# Altium project ConnectorBoard.PrjPcb
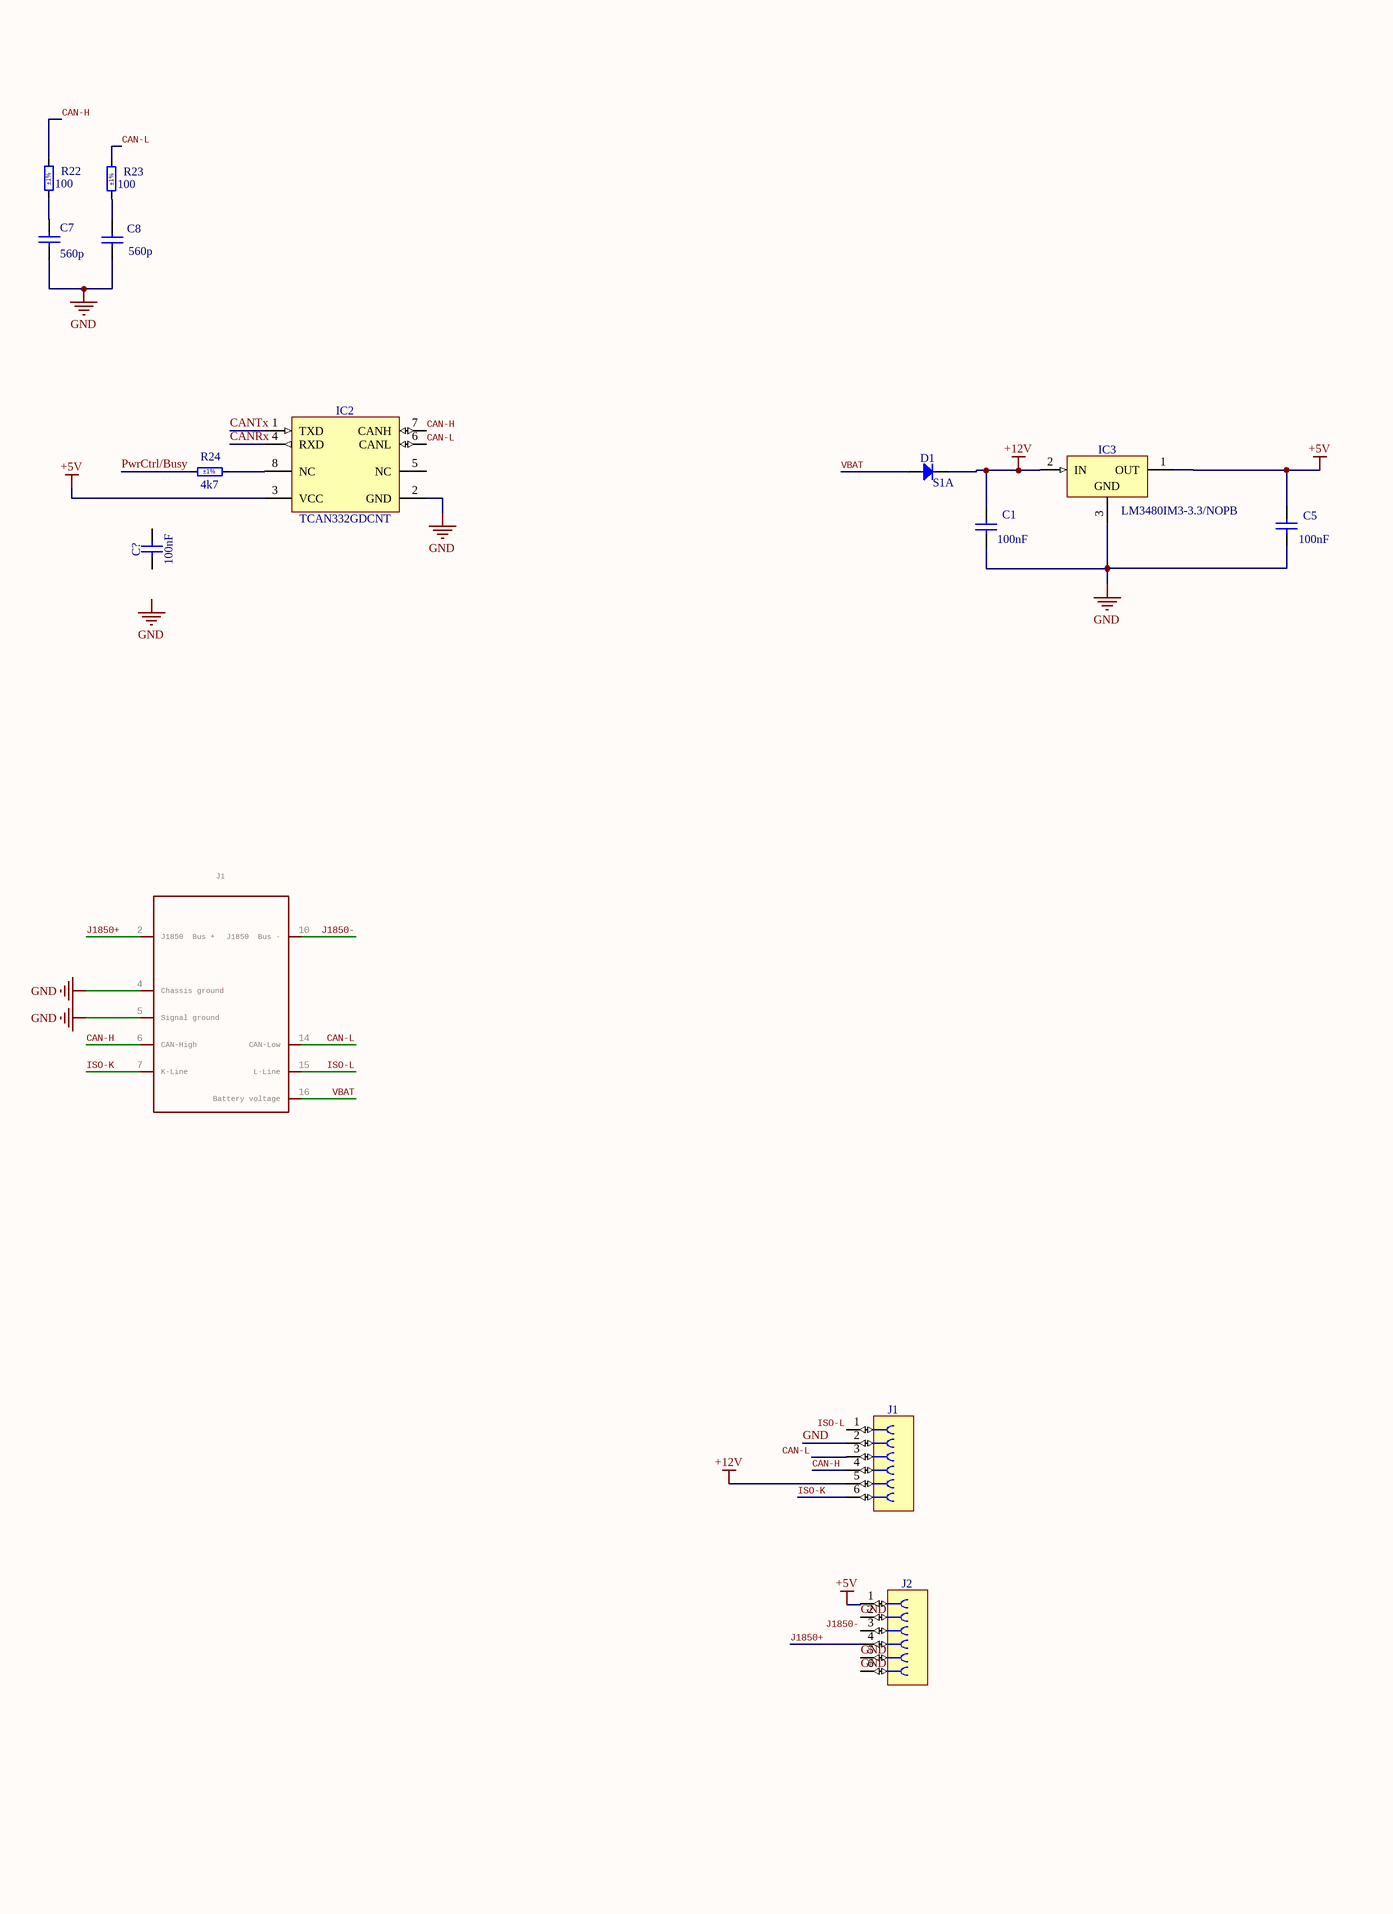
[diagram p0: ConnectorBoard.SchDoc]
1 sheet, 14 parts. Net scope: global (net labels, ports and power ports of the same name join across sheets).
Board file: ConnectorBoard.PcbDoc

## Sheet ConnectorBoard.SchDoc
size 260 x 358 mm; Origin: Eagle; OriginPath: C:\Users\Bimbo\Downloads\ELM327-based OBD-II interface.sch; OriginSheet: 1

### Parts
(Parts that share a designator on the sheet are numbered #1, #2 ... from top to bottom, then left to right.)
C1  100nF  [CAPC2012X135N]
C5  100nF  [CAPC2012X135N]
C7  560p  [CAPC2012X135N]
C8  560p  [CAPC2012X135N]
C?  100nF  [CAPC2012X135N]
D1  S1A  [DIOM5227X270N]
IC2  TCAN332GDCNT  [SOT65P280X145-8N]
IC3  LM3480IM3-3.3/NOPB  [SOT95P237X112-3N]
J1#1  J1850
Bus+: J1850 / Bus +  Signalground: Signal ground  J1850
Bus-: J1850 / Bus -  Batteryvoltage: Battery voltage  Chassisground: Chassis ground  [J1962_OBD_CONNECTOR]
J1#2  Socket 6  [3M_929974-01-06-RK]  (value not drawn)
J2  Socket 6  [3M_929974-01-06-RK]  (value not drawn)
R22  100  Tolerance: ±1%  [RESC2012X60N]
R23  100  Tolerance: ±1%  [RESC2012X60N]
R24  4k7  Tolerance: ±1%  [RESC2012X60N]

### Nets
+5V: C5.2 IC2.3(VCC) IC3.1(OUT) J2.1
+12V: C1.2 D1.1(C) IC3.2(IN) J1#2.5
GND: C1.1 C5.1 C7.1 C8.1 IC2.2(GND) IC3.3(GND) J1#1.4 J1#1.5 J1#2.2 J2.2 J2.5 J2.6
CAN-H: IC2.7(CANH) J1#1.6 J1#2.4 R22.2
CAN-L: IC2.6(CANL) J1#1.14 J1#2.3 R23.2
CANRx: IC2.4(RXD)
CANTx: IC2.1(TXD)
ISO-K: J1#1.7 J1#2.6
ISO-L: J1#1.15 J1#2.1
J1850+: J1#1.2 J2.4
J1850-: J1#1.10 J2.3
PwrCtrl/Busy: R24.2
VBAT: D1.2(A) J1#1.16
NetC7_2: C7.2 R22.1
NetC8_2: C8.2 R23.1
NetIC2_8: IC2.8(NC) R24.1

Not connected (* = marked no-connect by the designer): C? 1 2; IC2 5(NC)

### Notes on the sheet
- Labels drawn without touching a wire or pin: GND

### Library data of the parts
C1 C5 C7 C8 C? = CC0805_100NF_50V_10%_X7R: Non-polarised capacitor; Part Description: SMD Multilayer Chip Ceramic Capacitor; Manufacturer: GENERIC; Manufacturer1 Part Number: C2012X7R1H104K085; Voltage: 50V; TC: X7R; Tolerance: ±10%; Part Number: CC0805_100NF_50V_10%_X7R; Component Kind: Standard; Component Type: Standard; Pin Count: 2; Status: Preferred; Manufacturer Part Number: CC0805_100NF_50V_10%_X7R; Case: 0805; Mounted: Yes; Socket: No; SMD: Yes; Sense: No; Manufacturer1 Example: TDK; Manufacturer1 ComponentHeight: 1mm; HelpURL: \\cern.ch\dfs\Applications\Altium\Datasheets\CC0805_X7R_TDK_C.pdf; Author: CERN DEM JLC; CreateDate: 03.12.2007; LatestRevisionDate: 22.04.2015
  C1 C5 C?: Value: 100nF
  C7 C8: Value: 560p
D1 = S1A: Diode; Part Description: Surface Mount Glass Passivated Rectifier; Manufacturer: FAIRCHILD SEMICONDUCTOR; Voltage: 50V; Power: 1A; PressFit: No; Bonding: No; Part Number: S1A; Component Kind: Standard; Component Type: Standard; Device: S1A; PackageDescription: DO-214-AC/SMA Diode, Molded Body; 5.20mm L X 2.725mm W X 2.70mm H, IPC Medium Density; Manufacturer Part Number: S1A; Pin Count: 2; Case: DO-214AC; Mounted: Yes; Socket: No; SMD: Yes; Sense: No; ComponentHeight: 2.70mm; HelpURL: \\cern.ch\dfs\Applications\Altium\Datasheets\S1A.pdf; Author: CERN DEM JLC; CreateDate: 10.05.2010; LatestRevisionDate: 13.06.2012
IC2 = TCAN332GDCNT: 3.3V CAN Transceivers with CAN FD (Flexible Data Rate); Manufacturer: TEXAS INSTRUMENTS; PressFit: No; Bonding: No; Part Number: TCAN332GDCNT; Component Kind: Standard; Component Type: Standard; Device: TCAN332GDCNT; PackageDescription: SOT, 0.65mm Pitch; 8 pin, 1.625mm W X 2.90mm L X 1.45mm H body, IPC Medium Density; Part Description: 3.3V CAN Transceivers with CAN FD (Flexible Data Rate); Manufacturer Part Number: TCAN332GDCNT; Pin Count: 8; Case: SOT23-8; Mounted: Yes; Socket: No; SMD: Yes; Sense: No; ComponentHeight: 1.45mm; Author: CERN DEM JLC; HelpURL: \\cern.ch\dfs\Applications\Altium\Datasheets\TCAN332GDCNT.pdf; CreateDate: 22.08.2017; LatestRevisionDate: 22.08.2017
IC3 = LM3480IM3-3.3/NOPB: 3-Terminal Regulator 1=OUT 2=IN 3=GND; Part Description: 3.3V, 100 mA Quasi Low-Dropout Linear Voltage Regulator; Manufacturer: TEXAS INSTRUMENTS; PressFit: No; Bonding: No; Part Number: LM3480IM3-3.3/NOPB; Component Kind: Standard; Component Type: Standard; Device: LM3480IM3-3.3/NOPB; PackageDescription: SOT, 0.95mm, pitch; 3 pin,1.30mm W X 2.92mm L X 1.12mm H body, IPC Medium Density; Manufacturer Part Number: LM3480IM3-3.3/NOPB; Pin Count: 3; Case: SOT23-3; Mounted: Yes; Socket: No; SMD: Yes; Sense: No; ComponentHeight: 1.12mm; HelpURL: \\cern.ch\dfs\Applications\Altium\Datasheets\LM3480IM3-3.3-NOPB.pdf; Author: CERN DEM JLC; CreateDate: 04.12.2013; LatestRevisionDate: 04.12.2013
J1#1 = J1962_OBD_CONNECTOR: GateName_1: G$1; SymbolName_1: J1962_OBD_ONLY; DeviceName: ALL_HOLES; DeviceSetName: J1962_OBD_PADS_?; LibraryName: J1962; CAN-High: CAN-High; K-Line: K-Line; CAN-Low: CAN-Low; L-Line: L-Line
J1#2 J2 = 3M_929974-01-06-RK: Connector 6 Female; Part Description: 6 Contacts, Straight .100" x .100" Boardmount Socket, 929 Series; Manufacturer: 3M; PressFit: No; Part Number: 3M_929974-01-06-RK; Component Kind: Standard; Component Type: Standard; Pin Count: 6; Family: Socket 6; Mounted: Yes; Socket: No; SMD: No; Sense: No; Status: None; Manufacturer Part Number: 929974-01-06-RK; ComponentHeight: 8.26mm; HelpURL: \\cern.ch\dfs\Applications\Altium\Datasheets\3M_929974-01-06-RK.pdf; Author: CERN DEM JMW; CreateDate: 31.08.2016; LatestRevisionDate: 31.08.2016
R22 R23 = R0805_2K2_1%_0.125W_100PPM: Resistor - 1%; Part Description: General Purpose Thick Film Chip Resistor; Manufacturer: GENERIC; Manufacturer1 Part Number: NRC10F2201TRF; Power: 0.125W; TC: ±100ppm/°C; PressFit: No; Part Number: R0805_2K2_1%_0.125W_100PPM; Component Kind: Standard; Component Type: Standard; Pin Count: 2; Value: 100; Status: Preferred; Manufacturer Part Number: R0805_2K2_1%_0.125W_100PPM; Case: 0805; Mounted: Yes; Sense: No; Socket: No; SMD: Yes; Manufacturer1 Example: NIC COMPONENT; Manufacturer1 ComponentHeight: 0.6mm; HelpURL: \\cern.ch\dfs\Applications\Altium\Datasheets\R0805_NIC_NRC.pdf; Author: CERN DEM JLC; CreateDate: 03.12.2007; LatestRevisionDate: 13.03.2008
R24 = R0805_4K7_1%_0.125W_100PPM: Resistor - 1%; Part Description: General Purpose Thick Film Chip Resistor; Manufacturer: GENERIC; Manufacturer1 Part Number: NRC10F4701TRF; Power: 0.125W; TC: ±100ppm/°C; PressFit: No; Part Number: R0805_4K7_1%_0.125W_100PPM; Component Kind: Standard; Component Type: Standard; Pin Count: 2; Value: 4k7; Status: Preferred; Manufacturer Part Number: R0805_4K7_1%_0.125W_100PPM; Case: 0805; Mounted: Yes; Sense: No; Socket: No; SMD: Yes; Manufacturer1 Example: NIC COMPONENT; Manufacturer1 ComponentHeight: 0.6mm; HelpURL: \\cern.ch\dfs\Applications\Altium\Datasheets\R0805_NIC_NRC.pdf; Author: CERN DEM JLC; CreateDate: 03.12.2007; LatestRevisionDate: 13.03.2008